# Altium schematic sheet Tag Test Fixture.SchDoc
size C
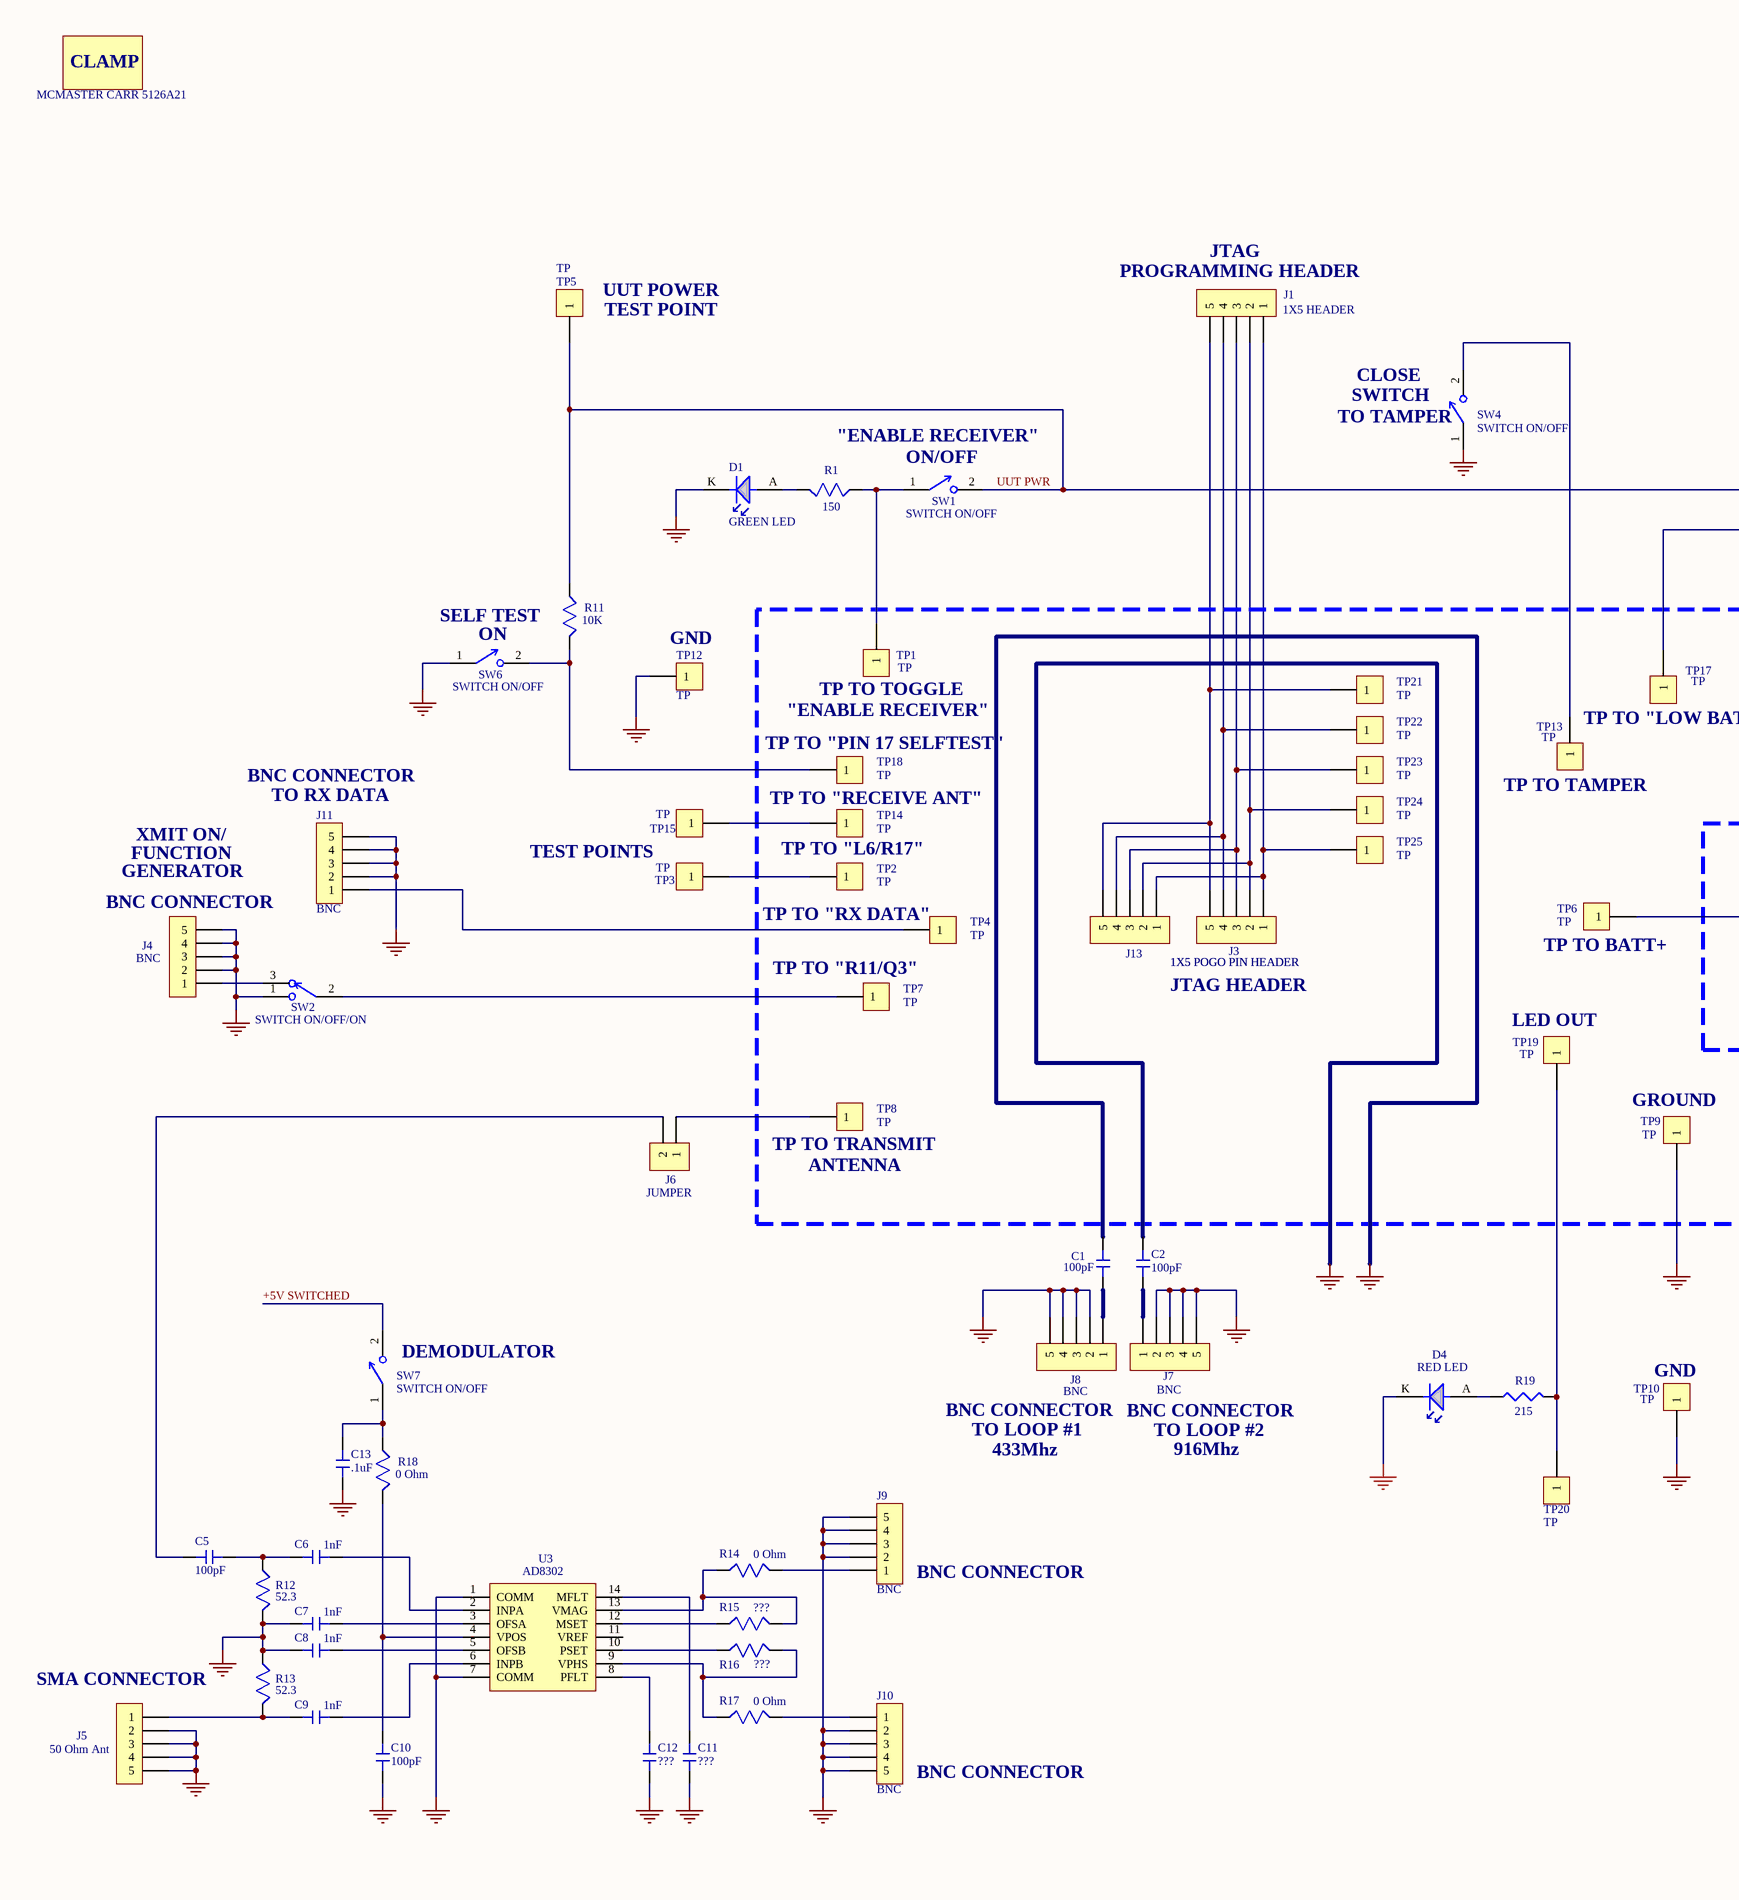
[diagram p0: Tag Test Fixture.SchDoc, left]
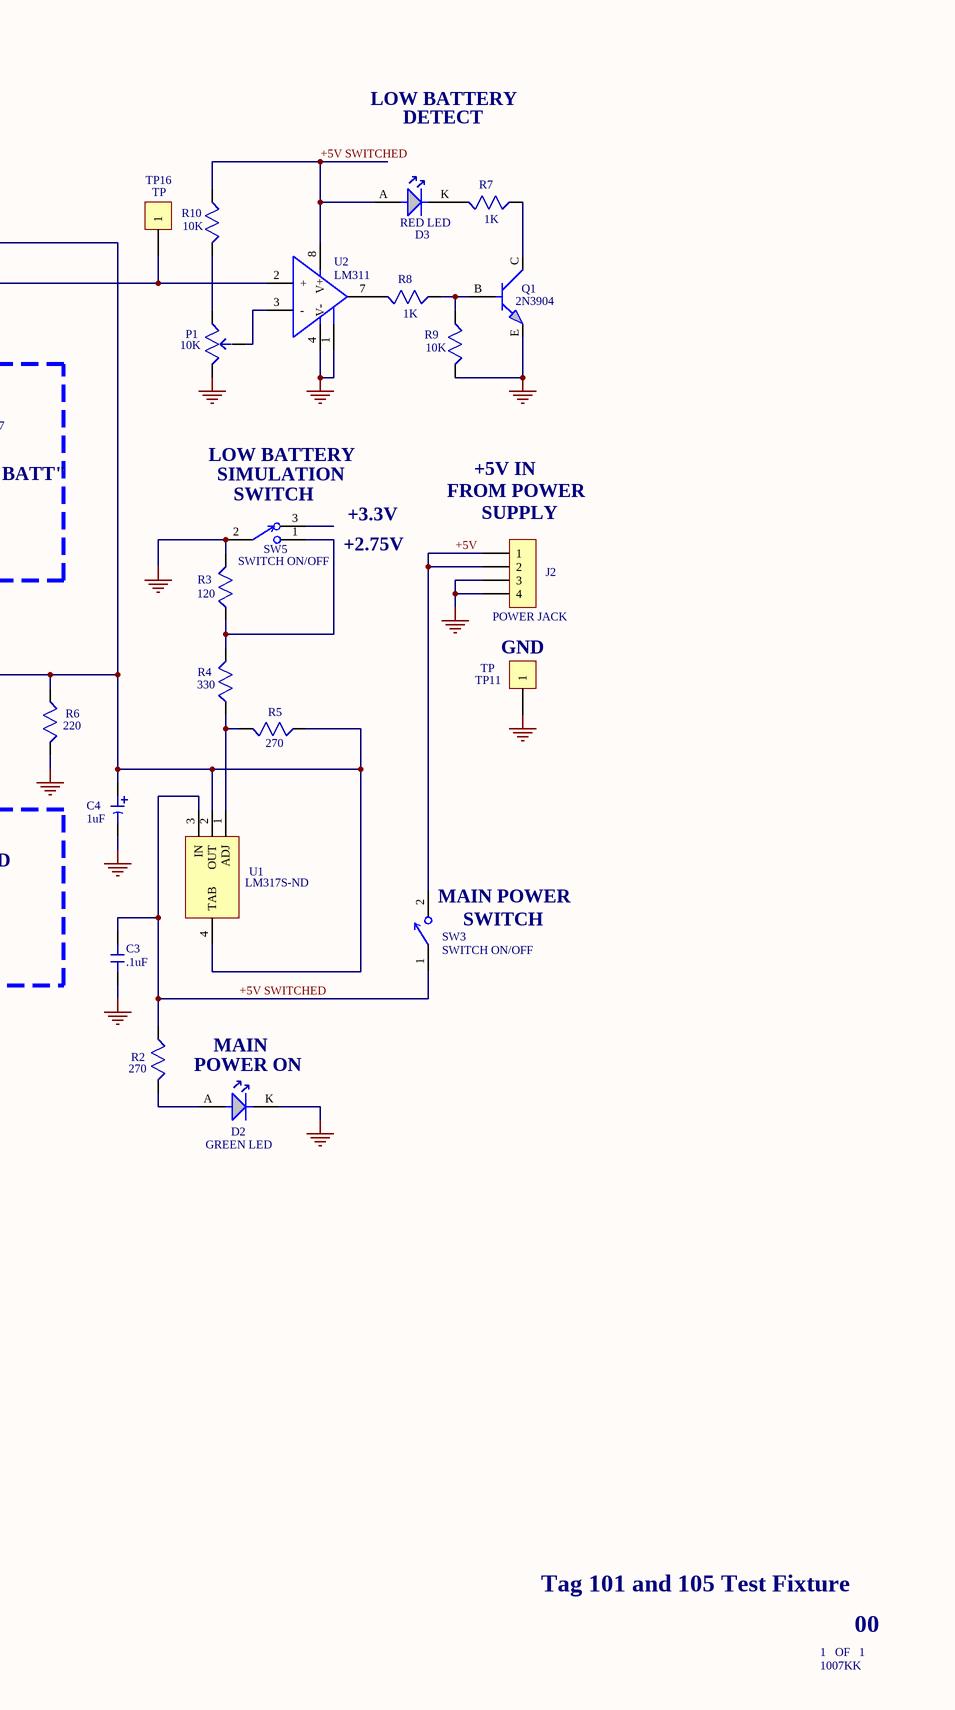
[diagram p1: Tag Test Fixture.SchDoc, right]

## Parts
C1  100pF  [0805_011905]
C2  100pF  [0805_011905]
C3  .1uF  [0805_011905]
C4  1uF  [CAP A CASE_030205]
C5  100pF  [0805_011905]
C6  1nF  [0603_072205]
C7  1nF  [0603_072205]
C8  1nF  [0603_072205]
C9  1nF  [0603_072205]
C10  100pF  [0603_072205]
C11  ???  [0603_072205]
C12  ???  [0603_072205]
C13  .1uF  [0603_072205]
CLAMP1  MCMASTER CARR 5126A21  [CLAMP MCMASTER CARR 5126A21]
D1  GREEN LED  [LED TH_021505]
D2  GREEN LED  [LED TH_021505]
D3  RED LED  [LED TH_021505]
D4  RED LED  [LED TH_021505]
J1  1X5 HEADER  [1X5 HEADER_011905]
J2  POWER JACK  [JACK POWER VPJ-002A-SMT_100307]
J3  1X5 POGO PIN HEADER  [1X5 POGO PIN HEADER]
J4  BNC  [CONN BNC A24516-ND_100307]
J5  50 Ohm Ant  [CONN SMA_060507]
J6  JUMPER  [1X2 HEADER_022205]
J7  BNC  [CONN BNC A24516-ND_100307]
J8  BNC  [CONN BNC A24516-ND_100307]
J9  BNC  [CONN BNC A24516-ND_100307]
J10  BNC  [CONN BNC A24516-ND_100307]
J11  BNC  [CONN BNC A24516-ND_100307]
J13  1X5 POGO PIN HEADER  [1X5 POGO PIN HEADER]
P1  10K  [POT TOP ADJUST_070306]
Q1  2N3904  [SOT23 TRANS_011905]
R1  150  [0805_011905]
R2  270  [0805_011905]
R3  120  [0805_011905]
R4  330  [0805_011905]
R5  270  [0805_011905]
R6  220  [2010_012005]
R7  1K  [0805_011905]
R8  1K  [0805_011905]
R9  10K  [0805_011905]
R10  10K  [0805_011905]
R11  10K  [0805_011905]
R12  52.3  [0603_072205]
R13  52.3  [0603_072205]
R14  0 Ohm  [0603_072205]
R15  ???  [0603_072205]
R16  ???  [0603_072205]
R17  0 Ohm  [0603_072205]
R18  0 Ohm  [0603_072205]
R19  215  [0805_011905]
SW1  SWITCH ON/OFF  [SWITCH M2012SS1W03 VERT_100807]
SW2  SWITCH ON/OFF/ON  [SWITCH M2013SS1W03 VERT_042705]
SW3  SWITCH ON/OFF  [SWITCH M2012SS1W03 VERT_100807]
SW4  SWITCH ON/OFF  [SWITCH M2012SS1W03 VERT_100807]
SW5  SWITCH ON/OFF  [SWITCH M2012SS1W03 VERT_100807]
SW6  SWITCH ON/OFF  [SWITCH M2012SS1W03 VERT_100807]
SW7  SWITCH ON/OFF  [SWITCH M2012SS1W03 VERT_100807]
TP1  TP  [POGO PIN PAD_100307]
TP2  TP  [POGO PIN PAD_100307]
TP3  TP  [TEST POINT PAD 2_100307]
TP4  TP  [POGO PIN PAD_100307]
TP5  TP  [TEST POINT PAD 2_100307]
TP6  TP  [POGO PIN PAD_100307]
TP7  TP  [POGO PIN PAD_100307]
TP8  TP  [POGO PIN PAD_100307]
TP9  TP  [POGO PIN PAD_100307]
TP10  TP  [TEST POINT PAD 2_100307]
TP11  TP  [TEST POINT PAD 2_100307]
TP12  TP  [TEST POINT PAD 2_100307]
TP13  TP  [POGO PIN PAD_100307]
TP14  TP  [POGO PIN PAD_100307]
TP15  TP  [TEST POINT PAD 2_100307]
TP16  TP  [TEST POINT PAD 2_100307]
TP17  TP  [POGO PIN PAD_100307]
TP18  TP  [POGO PIN PAD_100307]
TP19  TP  [POGO PIN PAD_100307]
TP20  TP  [TEST POINT PAD 2_100307]
TP21  TP  [POGO PIN PAD_100307]
TP22  TP  [POGO PIN PAD_100307]
TP23  TP  [POGO PIN PAD_100307]
TP24  TP  [POGO PIN PAD_100307]
TP25  TP  [POGO PIN PAD_100307]
U1  LM317S-ND  [TO263 REGULATOR_070306]
U2  LM311  [SO8_030205]
U3  AD8302  [TSSOP14_050405]

## Nets
GND: C1.1 C2.1 C3.2 C4.2 C7.1 C8.1 C10.2 C11.2 C12.2 C13.2 D1.K D2.K D4.K J2.3 J2.4 J4.2 J4.3 J4.4 J4.5 J5.2 J5.3 J5.4 J5.5 J7.2 J7.3 J7.4 J7.5 J8.2 J8.3 J8.4 J8.5 J9.2 J9.3 J9.4 J9.5 J10.2 J10.3 J10.4 J10.5 J11.2 J11.3 J11.4 J11.5 P1.3 Q1.E R3.1 R6.1 R9.1 R12.1 R13.2 SW2.1 SW4.1 SW5.2 SW6.1 TP9.1 TP10.1 TP11.1 TP12.1 U2.1 U2.4(V-) U3.1(COMM) U3.7(COMM)
+5V: J2.1 J2.2 SW3.2
+5V SWITCHED: C3.1 D3.A R2.2 R10.2 SW3.1 SW7.2 U1.3(IN) U2.8(V+)
UUT PWR: C4.1 R5.2 R6.2 R11.2 SW1.2 TP5.1 TP6.1 U1.2(OUT) U1.4(TAB)
NetC1_2: C1.2 J8.1
NetC2_2: C2.2 J7.1
NetC5_1: C5.1 C6.1 R12.2
NetC5_2: C5.2 J6.2
NetC6_2: C6.2 U3.2(INPA)
NetC7_2: C7.2 U3.3(OFSA)
NetC8_2: C8.2 U3.5(OFSB)
NetC9_1: C9.1 J5.1 R13.1
NetC9_2: C9.2 U3.6(INPB)
NetC10_1: C10.1 R18.1 U3.4(VPOS)
NetC11_1: C11.1 U3.14(MFLT)
NetC12_1: C12.1 U3.8(PFLT)
NetC13_1: C13.1 R18.2 SW7.1
NetD1_A: D1.A R1.1
NetD2_A: D2.A R2.1
NetD3_K: D3.K R7.1
NetD4_A: D4.A R19.1
NetJ1_1: J1.1 J3.1 J13.1 TP25.1
NetJ1_2: J1.2 J3.2 J13.2 TP24.1
NetJ1_3: J1.3 J3.3 J13.3 TP23.1
NetJ1_4: J1.4 J3.4 J13.4 TP22.1
NetJ1_5: J1.5 J3.5 J13.5 TP21.1
NetJ4_1: J4.1 SW2.3
NetJ6_1: J6.1 TP8.1
NetJ9_1: J9.1 R14.1
NetJ10_1: J10.1 R17.1
NetJ11_1: J11.1 TP4.1
NetP1_1: P1.1 R10.1
NetP1_2: P1.2 U2.3(-)
NetQ1_B: Q1.B R8.2 R9.2
NetQ1_C: Q1.C R7.2
NetR1_2: R1.2 SW1.1 TP1.1
NetR3_2: R3.2 R4.1 SW5.1
NetR4_2: R4.2 R5.1 U1.1(ADJ)
NetR8_1: R8.1 U2.7
NetR11_1: R11.1 SW6.2 TP18.1
NetR14_2: R14.2 R15.1 U3.13(VMAG)
NetR15_2: R15.2 U3.12(MSET)
NetR16_1: R16.1 R17.2 U3.9(VPHS)
NetR16_2: R16.2 U3.10(PSET)
NetR19_2: R19.2 TP19.1 TP20.1
NetSW2_2: SW2.2 TP7.1
NetSW4_2: SW4.2 TP13.1
NetTP2_1: TP2.1 TP3.1
NetTP14_1: TP14.1 TP15.1
NetTP16_1: TP16.1 TP17.1 U2.2(+)

Not connected (* = marked no-connect by the designer): SW5 3; U3 11(VREF)

## Notes on the sheet
- (near TP5) UUT POWER
- (near J1) PROGRAMMING HEADER
- JTAG
- (near TP5) TEST POINT
- LOW BATTERY
- (near SW4) TO TAMPER
- SWITCH
- CLOSE
- DETECT
- "ENABLE RECEIVER"
- (near SW1) ON/OFF
- SELF TEST
- (near SW6) ON
- (near TP12) GND
- (near TP1) TP TO TOGGLE
- (near TP18) TP TO "PIN 17 SELFTEST"
- TP TO "LOW BATT"
- (near SW5) SIMULATION
- (near SW5) SWITCH
- +3.3V
- (near J2) FROM POWER
- +5V IN
- (near J2) SUPPLY
- (near J11) BNC CONNECTOR
- (near J11) TO RX DATA
- TP TO "RECEIVE ANT"
- (near TP13) TP TO TAMPER
- +2.75V
- (near J4) GENERATOR
- FUNCTION
- XMIT ON/
- TEST POINTS
- TP TO "L6/R17"
- GND
- (near J4) BNC CONNECTOR
- TP TO "RX DATA"
- (near TP6) TP TO BATT+
- (near TP7) TP TO "R11/Q3"
- JTAG HEADER
- (near TP19) LED OUT
- (near TP8) TP TO TRANSMIT
- (near TP9) GROUND
- (near SW3) MAIN POWER
- (near SW3) SWITCH
- (near TP8) ANTENNA
- MAIN
- (near SW7) DEMODULATOR
- POWER ON
- BNC CONNECTOR
- TO LOOP #1
- TO LOOP #2
- (near TP10) GND
- 433Mhz
- 916Mhz
- (near J9) BNC CONNECTOR
- (near J5) SMA CONNECTOR
- (near J10) BNC CONNECTOR
- Tag 101 and 105 Test Fixture
- 1   OF   1
- 1007KK
- 00

## Library data of the parts
C1-C3 C5-C13 = CAP NP
C4 = CAP POL
CLAMP1 = CLAMP
D1-D4 = LED
J1 J3 J13 = CON5
J2 = CON4
J4 J5 J7-J11 = CON5: Connector
J6 = CON2
P1 = POT
Q1 = NPN
R1-R18 = RESISTOR
R19 = RES1
SW2 SW5 = SWITCH SPDT
TP1-TP25 = CON1: Connector
U1 = LM317